# Altium project PCB_DYBoard_Bandmaster_V2.PrjPcb
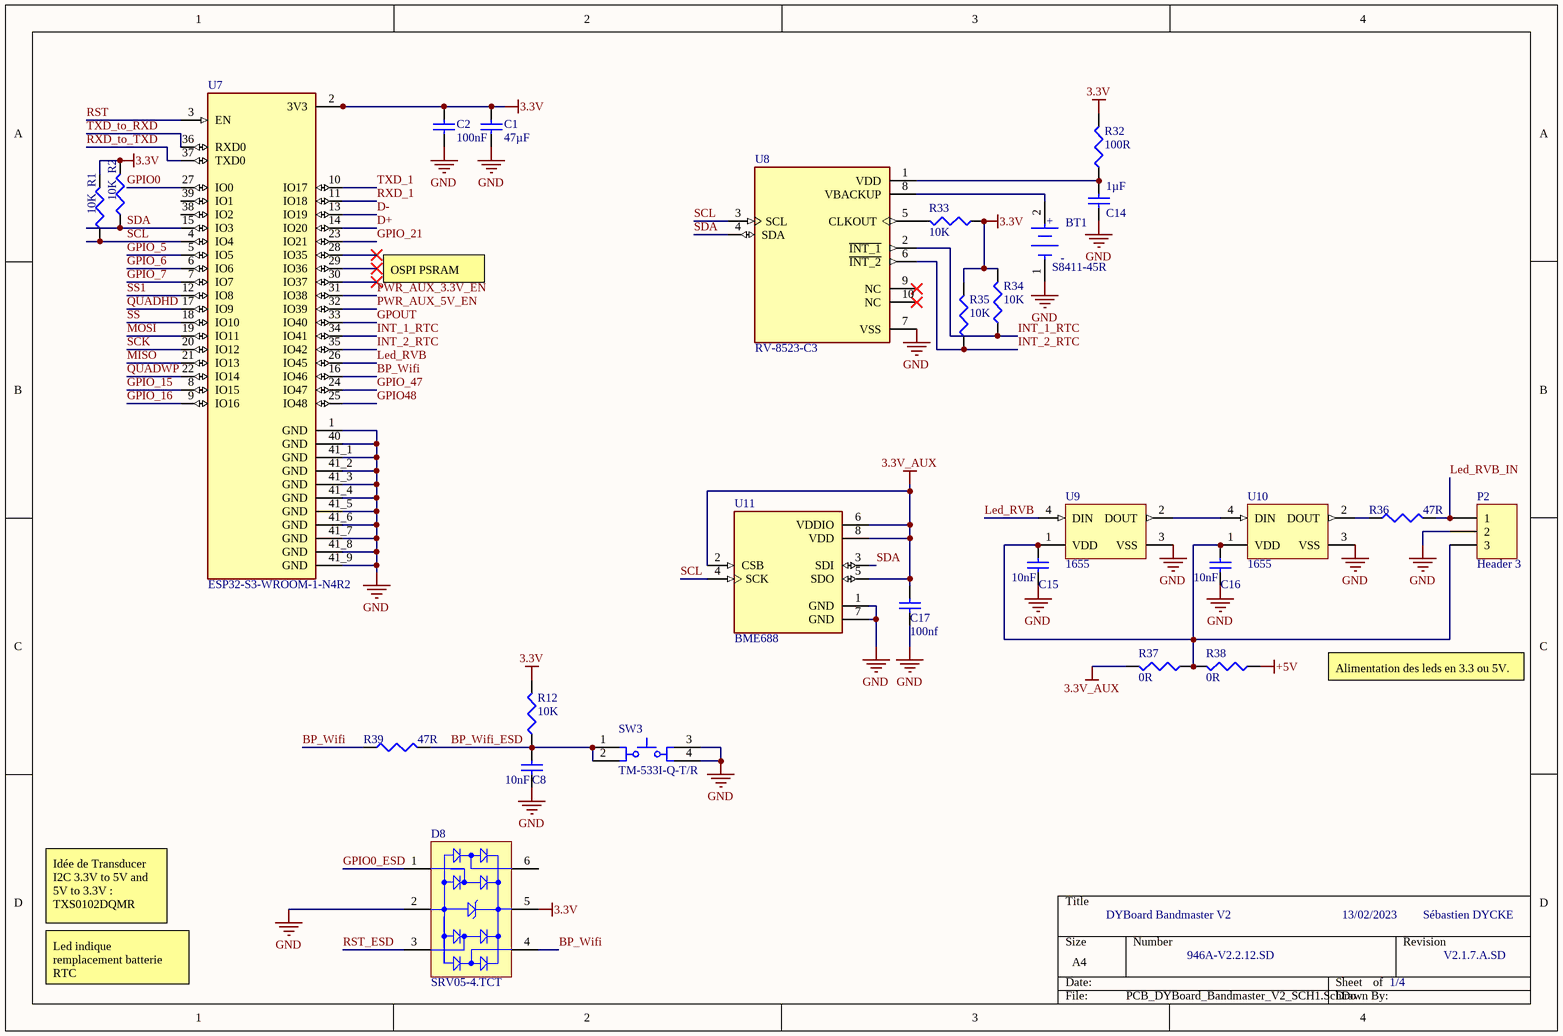
[diagram p0: PCB_DYBoard_Bandmaster_V2_SCH1.SchDoc]
4 sheets, 138 parts. Net scope: global (net labels, ports and power ports of the same name join across sheets).
Board file: PCB_DYBoard_Bandmaster_V2.PcbDoc
Sheets:
  PCB_DYBoard_Bandmaster_V2_SCH1.SchDoc
  PCB_DYBoard_Bandmaster_V2_SCH2.SchDoc
  PCB_DYBoard_Bandmaster_V2_SCH3.SchDoc
  PCB_DYBoard_Bandmaster_V2_SCH4.SchDoc

## Sheet PCB_DYBoard_Bandmaster_V2_SCH1.SchDoc
size A4; SheetNumber: 1; SheetTotal: 4

### Parts
BT1  S8411-45R  [FP-S8411-45R-MFG]
C1  value 47µF  [1608[0603]]  (hidden comment: Cap Semi)
C2  value 100nF  [1608[0603]]  (hidden comment: Cap Semi)
C8  value 10nF  [1608[0603]]  (hidden comment: Cap Semi)
C14  value 1µF  [1608[0603]]  (hidden comment: Cap Semi)
C15  value 10nF  [1608[0603]]  (hidden comment: Cap Semi)
C16  value 10nF  [1608[0603]]  (hidden comment: Cap Semi)
C17  value 100nf  [1608[0603]]  (hidden comment: Cap Semi)
D8  SRV05-4.TCT  [SMTC-SOT23-6_V]
P2  Header 3  [HDR1X3]
R1  value 10K  [J1-0603]  (hidden comment: Res3)
R2  value 10K  [J1-0603]  (hidden comment: Res3)
R12  value 10K  [J1-0603]  (hidden comment: Res3)
R32  value 100R  [J1-0603]  (hidden comment: Res3)
R33  value 10K  [J1-0603]  (hidden comment: Res3)
R34  value 10K  [J1-0603]  (hidden comment: Res3)
R35  value 10K  [J1-0603]  (hidden comment: Res3)
R36  value 47R  [J1-0603]  (hidden comment: Res3)
R37  value 0R  [J1-0603]  (hidden comment: Res3)
R38  value 0R  [J1-0603]  (hidden comment: Res3)
R39  value 47R  [J1-0603]  (hidden comment: Res3)
SW3  TM-533I-Q-T/R  [MULT-TM-533I-Q_V]
U7  ESP32-S3-WROOM-1-N4R2  [XCVR_ESP32-S3-WROOM-1-N4R2]
U8  RV-8523-C3  [IC_RV-8523-C3]
U9  1655  [ADA-RGB-1655_V]
U10  1655  [ADA-RGB-1655_V]
U11  BME688  [IC_BME688]

### Nets
3.3V: C1.2 C2.2 D8.5(VBUS) R1.2 R2.2 R12.2 R32.2 R33.1 R34.2 R35.2 U7.2(3V3)
3.3V_AUX: C17.2 R37.2 U11.2(CSB) U11.5(SDO) U11.6(VDDIO) U11.8(VDD)
+5V: R38.1
GND: BT1.1(C) C1.1 C2.1 C8.1 C14.1 C15.1 C16.1 C17.1 D8.2(GND) P2.2 SW3.3 SW3.4 U7.1(GND) U7.40(GND) U7.41_1(GND) U7.41_2(GND) U7.41_3(GND) U7.41_4(GND) U7.41_5(GND) U7.41_6(GND) U7.41_7(GND) U7.41_8(GND) U7.41_9(GND) U8.7(VSS) U9.3(VSS) U10.3(VSS) U11.1(GND) U11.7(GND)
BP_Wifi: D8.4(I/O_3) R39.1 U7.16(IO46)
BP_Wifi_ESD: C8.2 R12.1 R39.2 SW3.1 SW3.2
D+: U7.14(IO20)
D-: U7.13(IO19)
GPIO0: U7.27(IO0)
GPIO0_ESD: D8.1(I/O_1)
GPIO48: U7.25(IO48)
GPIO_5: U7.5(IO5)
GPIO_6: U7.6(IO6)
GPIO_7: U7.7(IO7)
GPIO_15: U7.8(IO15)
GPIO_16: U7.9(IO16)
GPIO_21: U7.23(IO21)
GPIO_47: U7.24(IO47)
GPOUT: U7.33(IO40)
INT_1_RTC: R34.1 U7.34(IO41) U8.2(~{INT_1})
INT_2_RTC: R35.1 U7.35(IO42) U8.6(~{INT_2})
Led_RVB: U7.26(IO45) U9.4(DIN)
Led_RVB_IN: P2.1 R36.2
MISO: U7.21(IO13)
MOSI: U7.19(IO11)
PWR_AUX_3.3V_EN: U7.31(IO38)
PWR_AUX_5V_EN: U7.32(IO39)
QUADHD: U7.17(IO9)
QUADWP: U7.22(IO14)
RST: U7.3(EN)
RST_ESD: D8.3(I/O_2)
RXD_1: U7.11(IO18)
RXD_to_TXD: U7.37(TXD0)
SCK: U7.20(IO12)
SCL: R1.1 U7.4(IO4) U8.3(SCL) U11.4(SCK)
SDA: R2.1 U7.15(IO3) U8.4(SDA) U11.3(SDI)
SS: U7.18(IO10)
SS1: U7.12(IO8)
TXD_1: U7.10(IO17)
TXD_to_RXD: U7.36(RXD0)
NetBT1_2: BT1.2(A) U8.8(VBACKUP)
NetC14_2: C14.2 R32.1 U8.1(VDD)
NetC15_2: C15.2 C16.2 P2.3 R37.1 R38.2 U9.1(VDD) U10.1(VDD)
NetR33_2: R33.2 U8.5(CLKOUT)
NetR36_1: R36.1 U10.2(DOUT)
NetU9_2: U9.2(DOUT) U10.4(DIN)

Not connected (* = marked no-connect by the designer): D8 6(I/O_4); U7 28(IO35)* 29(IO36)* 30(IO37)* 38(IO2) 39(IO1); U8 9(NC)* 10(NC)*

### Notes on the sheet
- OSPI PSRAM
- Alimentation des leds en 3.3 ou 5V.
- Idée de Transducer I2C 3.3V to 5V and 5V to 3.3V : TXS0102DQMR
- DYBoard Bandmaster V2
- 13/02/2023
- Sébastien DYCKE
- Led indique remplacement batterie RTC
- 946A-V2.2.12.SD
- 1/4
- V2.1.7.A.SD
- (in symbol CMP-15817-000007-1) +; -

### Library data of the parts
BT1 = CMP-15817-000007-1: BATTERY HOLDER COIN 12MM SMD; Number of Batteries: 1; Material: Polyphenylene; Case/Package: SMD/SMT; Number of Cells: 1; Min Operating Temperature: -55°C; Termination: SMD/SMT; REACH SVHC: No SVHC; Contact Plating: Bronze; Package Quantity: 500; Max Operating Temperature: 105°C; Mount: Surface Mount; Packaging: Tape and Reel
C1 C2 C8 C14-C17 = Cap Semi: Capacitor (Semiconductor SIM Model); Published: 8-Jun-2000; LatestRevisionDate: 29-May-2009; LatestRevisionNote: IPC-7351 Footprint Added.; PackageReference: C1206; Publisher: Altium Limited; PackageDescription: Chip Capacitor
D8 = CMP-2000-05358-1: RailClamp(R) Low Capacitance TVS Diode Array, 5 pF, 17.5 VC, -55 to 125 degC, 6-Pin SOT23, RoHS, Tape and Reel; Manufacturer: Semtech; Leakage Current (Max): 5uA; Polarity: Uni-Directional; Peak Pulse Power Dissipation: 300W; Clamping Voltage: 17.5V; Number of Elements: 1; Working Voltage: 5V; Test Current (It): 1mA; Configuration: Quad; Reverse Breakdown Voltage: 6V; Suppressor Type: DiodeArrays; Peak Pulse Current: 12A; Product Depth (mm): 1.6mm; Product Height (mm): 1.15mm; Clamping Voltage (Max): 12.5V; Rad Hardened: No; Product Length (mm): 2.9mm; Capacitance Value: 5pF; Mounting: SurfaceMount; Datasheet URL: https://datasheet.ciiva.com/8029/srv05-4-8029973.pdf; Datasheet Version: Jan-08; Packaging: TapeandReel; Package / Case: SOT-23; Operating Temp Range: -55Cto125C; Pin Count: 6; Direction Type: Uni-Directional; Operating Temperature Min Deg. C: -55C; Reverse Stand-off Voltage: 5V; Leakage Current: 5uA; Manufacturer URL: http://www.semtech.com/; Working Voltage (Max): 5V; Package Reference: SOT23-6; Package Description: 6-Pin Small Outline Transistor, Body 2.9 x 1.6 mm, Pitch 0.95 mm; Operating Temperature Max Deg. C: 125C; Operating Temperature Classification: Military; Mounting Style: SurfaceMount
P2 = Header 3: Header, 3-Pin; LatestRevisionDate: 17-Jul-2002; LatestRevisionNote: Re-released for DXP Platform.; Publisher: Altium Limited
R1 R2 R12 R32-R39 = Res3: Resistor; Published: 8-Jun-2000; LatestRevisionDate: 29-May-2009; LatestRevisionNote: IPC-7351 Footprint Added.; PackageReference: J1-0603; Publisher: Altium Limited; PackageDescription: Chip Resistor
SW3 = CMP-1762-00001-1: TACT Switch, SPNO, -25 to 70 degC, 4-Pin SMD, RoHS, Tape and Reel; PackageDescription: 4-Pin Surface Mount Device, Body 5.2 x 5.2 mm; PackageReference: TM-533I-Q-T/R; DatasheetVersion: Rev. 1.1, 12/2011; ComponentLink1Description: Datasheet; ComponentLink1URL: http://www.micropik.com/PDF/pul5x5.pdf
U7 = ESP32-S3-WROOM-1-N4R2: Bluetooth, WiFi 802.11b/g/n, Bluetooth v5.0 Transceiver Module 2.4GHz PCB Trace Surface Mount; MF: Espressif Systems; Package: None; Purchase-URL: https://pricing.snapeda.com/search/part/ESP32-S3-WROOM-1-N4R2/?ref=eda; Price: None; Availability: In Stock; Check_prices: https://www.snapeda.com/parts/ESP32-S3-WROOM-1-N4R2/Espressif+Systems/view-part/?ref=eda; MP: ESP32-S3-WROOM-1-N4R2; SnapEDA_Link: https://www.snapeda.com/parts/ESP32-S3-WROOM-1-N4R2/Espressif+Systems/view-part/?ref=snap; Value: *
U9 U10 = CMP-2000-05026-1: Intelligent Control LED Integrated Light Source, 3.5 to 5.3 V, -25 to 80 degC, 4-Pin SMD, RoHS, Tape and Reel; Manufacturer: Adafruit-Industries-LLC; Number of LEDs: 10; Configuration: Discrete; Utilized LED: WS2812(5050); Datasheet URL: http://datasheet.octopart.com/ADA1655-Adafruit-Industries-datasheet-32028139.pdf; Series: Neopixel; Interface: -; Package Description: 4-Pin Surface Mount Device, Body 5 x 5 mm; Color: Red,Green,Blue(RGB); Category: Optoelectronics; Controller Type: -; Package Reference: 1655; Manufacturer URL: https://www.adafruit.com/; Mounting Type: SurfaceMount; Datasheet Version: May-13; Size / Dimension: 5.00mmLx5.00mmW; Family: Addressable,Specialty
U11 = BME688: Gas sensor measuring relative humidity, barometric pressure, ambient temperature and gas (VOC); Package: None; MP: BME688; Price: None; Availability: Unavailable; Value: *
U8 = RV-8523-C3: Package: None; Value: *; MP: RV-8523-C3; Availability: Unavailable; Price: None

## Sheet PCB_DYBoard_Bandmaster_V2_SCH2.SchDoc
size A4; SheetNumber: 2; SheetTotal: 4
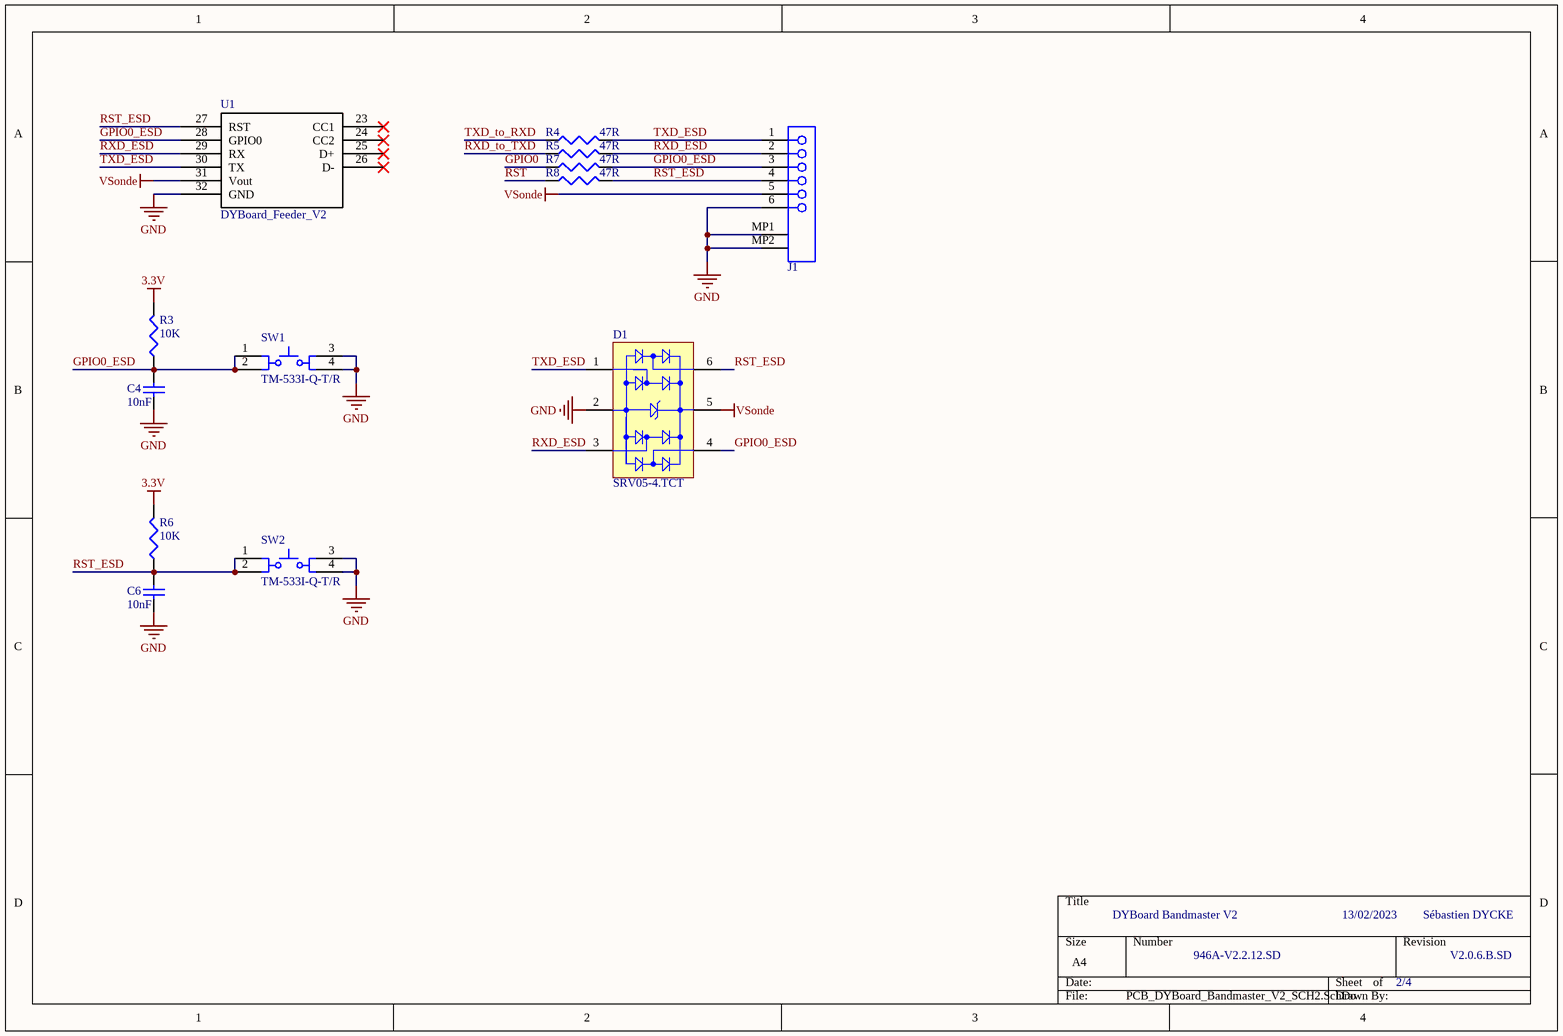
[diagram p1: PCB_DYBoard_Bandmaster_V2_SCH2.SchDoc]

### Parts
C4  value 10nF  [1608[0603]]  (hidden comment: Cap Semi)
C6  value 10nF  [1608[0603]]  (hidden comment: Cap Semi)
D1  SRV05-4.TCT  [SMTC-SOT23-6_V]
J1  SEB_MOLeX_6p  [SEB_MOLeX_6p]  (value not drawn)
R3  value 10K  [J1-0603]  (hidden comment: Res3)
R4  value 47R  [J1-0603]  (hidden comment: Res3)
R5  value 47R  [J1-0603]  (hidden comment: Res3)
R6  value 10K  [J1-0603]  (hidden comment: Res3)
R7  value 47R  [J1-0603]  (hidden comment: Res3)
R8  value 47R  [J1-0603]  (hidden comment: Res3)
SW1  TM-533I-Q-T/R  [MULT-TM-533I-Q_V]
SW2  TM-533I-Q-T/R  [MULT-TM-533I-Q_V]
U1  DYBoard_Feeder_V2  [DYBoard_Feeder_V2]

### Nets
3.3V: R3.2 R6.2
GND: C4.1 C6.1 D1.2(GND) J1.6 J1.MP1 J1.MP2 SW1.3 SW1.4 SW2.3 SW2.4 U1.32(GND)
VSonde: D1.5(VBUS) J1.5 U1.31(Vout)
GPIO0: R7.1
GPIO0_ESD: C4.2 D1.4(I/O_3) J1.3 R3.1 R7.2 SW1.1 SW1.2 U1.28(GPIO0)
RST: R8.1
RST_ESD: C6.2 D1.6(I/O_4) J1.4 R6.1 R8.2 SW2.1 SW2.2 U1.27(RST)
RXD_ESD: D1.3(I/O_2) J1.2 R5.2 U1.29(RX)
RXD_to_TXD: R5.1
TXD_ESD: D1.1(I/O_1) J1.1 R4.2 U1.30(TX)
TXD_to_RXD: R4.1

Not connected (* = marked no-connect by the designer): U1 23(CC1)* 24(CC2)* 25(D+)* 26(D-)*

### Notes on the sheet
- DYBoard Bandmaster V2
- 13/02/2023
- Sébastien DYCKE
- 946A-V2.2.12.SD
- 2/4
- V2.0.6.B.SD

### Library data of the parts
C4 C6 = Cap Semi: Capacitor (Semiconductor SIM Model); Published: 8-Jun-2000; LatestRevisionDate: 29-May-2009; LatestRevisionNote: IPC-7351 Footprint Added.; PackageReference: C1206; Publisher: Altium Limited; PackageDescription: Chip Capacitor
D1 = CMP-2000-05358-1: as D8 on sheet PCB_DYBoard_Bandmaster_V2_SCH1; Mounting: SurfaceMount; Datasheet URL: https://datasheet.ciiva.com/8029/srv05-4-8029973.pdf; Datasheet Version: Jan-08; Packaging: TapeandReel; Package / Case: SOT-23; Operating Temp Range: -55Cto125C; Pin Count: 6; Direction Type: Uni-Directional; Operating Temperature Min Deg. C: -55C; Reverse Stand-off Voltage: 5V; Leakage Current: 5uA; Manufacturer URL: http://www.semtech.com/; Working Voltage (Max): 5V; Package Reference: SOT23-6; Package Description: 6-Pin Small Outline Transistor, Body 2.9 x 1.6 mm, Pitch 0.95 mm; Operating Temperature Max Deg. C: 125C; Operating Temperature Classification: Military; Mounting Style: SurfaceMount
R3-R8 = Res3: Resistor; Published: 8-Jun-2000; LatestRevisionDate: 29-May-2009; LatestRevisionNote: IPC-7351 Footprint Added.; PackageReference: J1-0603; Publisher: Altium Limited; PackageDescription: Chip Resistor
SW1 SW2 = CMP-1762-00001-1: as SW3 on sheet PCB_DYBoard_Bandmaster_V2_SCH1; PackageDescription: 4-Pin Surface Mount Device, Body 5.2 x 5.2 mm; PackageReference: TM-533I-Q-T/R; DatasheetVersion: Rev. 1.1, 12/2011; ComponentLink1Description: Datasheet; ComponentLink1URL: http://www.micropik.com/PDF/pul5x5.pdf

## Sheet PCB_DYBoard_Bandmaster_V2_SCH3.SchDoc
size A4; SheetNumber: 3; SheetTotal: 4; SPICEModelCacheXCLFXDFF: <root> / <DocumentId>XCLFXDFF</DocumentId> / </root>
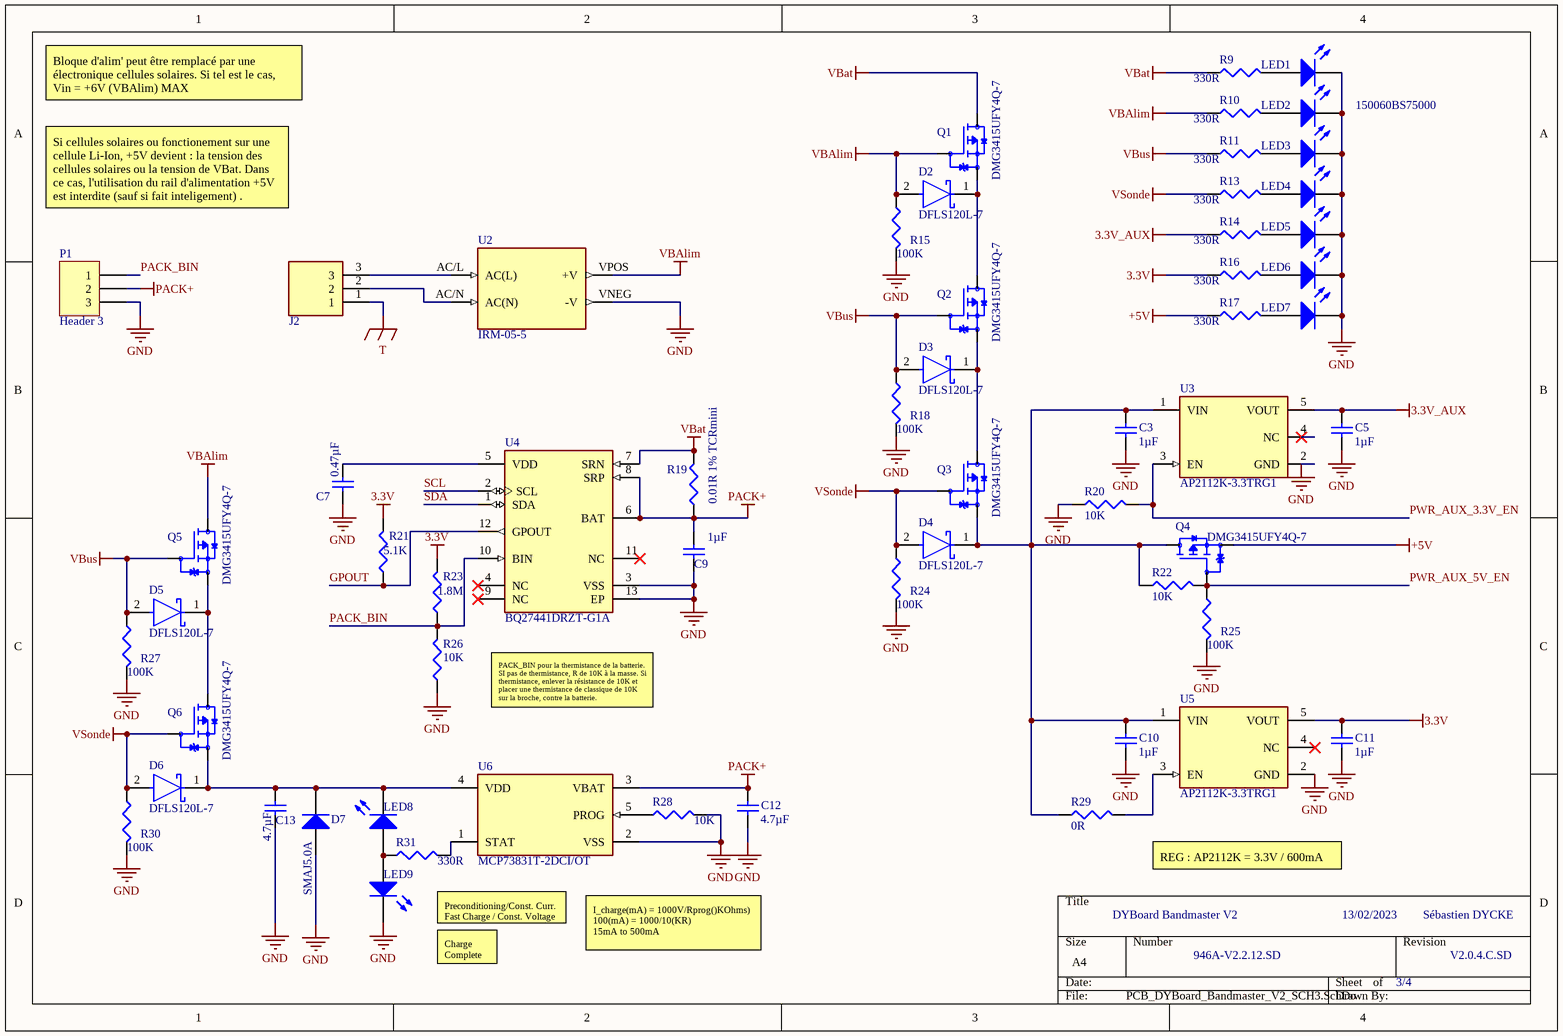
[diagram p2: PCB_DYBoard_Bandmaster_V2_SCH3.SchDoc]

### Parts
C3  value 1µF  [1608[0603]]  (hidden comment: Cap Semi)
C5  value 1µF  [1608[0603]]  (hidden comment: Cap Semi)
C7  value 0.47µF  [1608[0603]]  (hidden comment: Cap Semi)
C9  value 1µF  [1608[0603]]  (hidden comment: Cap Semi)
C10  value 1µF  [1608[0603]]  (hidden comment: Cap Semi)
C11  value 1µF  [1608[0603]]  (hidden comment: Cap Semi)
C12  value 4.7µF  [1608[0603]]  (hidden comment: Cap Semi)
C13  value 4.7µF  [1608[0603]]  (hidden comment: Cap Semi)
D2  DFLS120L-7  [FP-PowerDI123-MFG]
D3  DFLS120L-7  [FP-PowerDI123-MFG]
D4  DFLS120L-7  [FP-PowerDI123-MFG]
D5  DFLS120L-7  [FP-PowerDI123-MFG]
D6  DFLS120L-7  [FP-PowerDI123-MFG]
D7  SMAJ5.0A  [BOUR-SMA-2_V]
J2  TBP02R2-381-03BE  [CUI_TBP02R2-381-03BE]  (value not drawn)
LED1  150060BS75000  [0603_A]  (value not drawn)
LED2  150060BS75000  [0603_A]
LED3  150060BS75000  [0603_A]  (value not drawn)
LED4  150060BS75000  [0603_A]  (value not drawn)
LED5  150060BS75000  [0603_A]  (value not drawn)
LED6  150060BS75000  [0603_A]  (value not drawn)
LED7  150060BS75000  [0603_A]  (value not drawn)
LED8  150060BS75000  [0603_A]  (value not drawn)
LED9  150060BS75000  [0603_A]  (value not drawn)
P1  Header 3  [HDR1X3]
Q1  DMG3415UFY4Q-7  [TRANS_DMG3415UFY4Q-7]
Q2  DMG3415UFY4Q-7  [TRANS_DMG3415UFY4Q-7]
Q3  DMG3415UFY4Q-7  [TRANS_DMG3415UFY4Q-7]
Q4  DMG3415UFY4Q-7  [TRANS_DMG3415UFY4Q-7]
Q5  DMG3415UFY4Q-7  [TRANS_DMG3415UFY4Q-7]
Q6  DMG3415UFY4Q-7  [TRANS_DMG3415UFY4Q-7]
R9  value 330R  [J1-0603]  (hidden comment: Res3)
R10  value 330R  [J1-0603]  (hidden comment: Res3)
R11  value 330R  [J1-0603]  (hidden comment: Res3)
R13  value 330R  [J1-0603]  (hidden comment: Res3)
R14  value 330R  [J1-0603]  (hidden comment: Res3)
R15  value 100K  [J1-0603]  (hidden comment: Res3)
R16  value 330R  [J1-0603]  (hidden comment: Res3)
R17  value 330R  [J1-0603]  (hidden comment: Res3)
R18  value 100K  [J1-0603]  (hidden comment: Res3)
R19  value 0.01R 1% TCRmini  [J1-0603]  (hidden comment: Res3)
R20  value 10K  [J1-0603]  (hidden comment: Res3)
R21  value 5.1K  [J1-0603]  (hidden comment: Res3)
R22  value 10K  [J1-0603]  (hidden comment: Res3)
R23  value 1.8M  [J1-0603]  (hidden comment: Res3)
R24  value 100K  [J1-0603]  (hidden comment: Res3)
R25  value 100K  [J1-0603]  (hidden comment: Res3)
R26  value 10K  [J1-0603]  (hidden comment: Res3)
R27  value 100K  [J1-0603]  (hidden comment: Res3)
R28  value 10K  [J1-0603]  (hidden comment: Res3)
R29  value 0R  [J1-0603]  (hidden comment: Res3)
R30  value 100K  [J1-0603]  (hidden comment: Res3)
R31  value 330R  [J1-0603]  (hidden comment: Res3)
U2  IRM-05-5  [CONV_IRM-05-5]
U3  AP2112K-3.3TRG1  [FP-SOT25-IPC_A]
U4  BQ27441DRZT-G1A  [FP-DRZ0012A-MFG]
U5  AP2112K-3.3TRG1  [FP-SOT25-IPC_A]
U6  MCP73831T-2DCI/OT  [FP-C04-091-OT-IPC_B]

### Nets
3.3V: C11.2 R16.1 R21.2 R23.2 U5.5(VOUT)
3.3V_AUX: C5.2 R14.1 U3.5(VOUT)
+5V: Q4.2(S) R17.1
GND: C3.1 C5.1 C7.1 C9.1 C10.1 C11.1 C12.1 C13.1 D7.1(A) LED1.1(K) LED2.1(K) LED3.1(K) LED4.1(K) LED5.1(K) LED6.1(K) LED7.1(K) LED9.1(K) P1.3 R15.2 R18.2 R20.1 R24.2 R25.2 R26.1 R27.2 R28.2 R30.2 U2.VNEG(-V) U3.2(GND) U4.3(VSS) U4.13(EP) U5.2(GND) U6.2(VSS)
PACK+: C9.2 C12.2 P1.2 R19.1 U4.6(BAT) U4.8(SRP) U6.3(VBAT)
T: J2.1
VBAlim: D2.2(A) Q1.1(G) Q5.3(D) R10.1 R15.1 U2.VPOS(+V)
VBat: Q1.3(D) R9.1 R19.2 U4.7(SRN)
VBus: D3.2(A) D5.2(A) Q2.1(G) Q5.1(G) R11.1 R18.1 R27.1
VSonde: D4.2(A) D6.2(A) Q3.1(G) Q6.1(G) R13.1 R24.1 R30.1
GPOUT: R21.1 U4.12(GPOUT)
PACK_BIN: P1.1 R23.1 R26.2 U4.10(BIN)
PWR_AUX_3.3V_EN: R20.2 U3.3(EN)
PWR_AUX_5V_EN: Q4.1(G) R22.2 R25.1
SCL: U4.2(SCL)
SDA: U4.1(SDA)
NetC3_2: C3.2 C10.2 D4.1(C) Q3.2(S) Q4.3(D) R22.1 R29.1 U3.1(VIN) U5.1(VIN)
NetC7_2: C7.2 U4.5(VDD)
NetC13_2: C13.2 D6.1(C) D7.2(K) LED8.1(K) Q6.2(S) U6.4(VDD)
NetD2_1: D2.1(C) Q1.2(S) Q2.3(D)
NetD3_1: D3.1(C) Q2.2(S) Q3.3(D)
NetD5_1: D5.1(C) Q5.2(S) Q6.3(D)
NetJ2_2: J2.2 U2.AC/N(AC(N))
NetJ2_3: J2.3 U2.AC/L(AC(L))
NetLED1_2: LED1.2(A) R9.2
NetLED2_2: LED2.2(A) R10.2
NetLED3_2: LED3.2(A) R11.2
NetLED4_2: LED4.2(A) R13.2
NetLED5_2: LED5.2(A) R14.2
NetLED6_2: LED6.2(A) R16.2
NetLED7_2: LED7.2(A) R17.2
NetLED8_2: LED8.2(A) LED9.2(A) R31.1
NetR28_1: R28.1 U6.5(PROG)
NetR29_2: R29.2 U5.3(EN)
NetR31_2: R31.2 U6.1(STAT)

Not connected (* = marked no-connect by the designer): U3 4(NC)*; U4 4(NC)* 9(NC)* 11(NC)*; U5 4(NC)*

### Notes on the sheet
- Bloque d'alim' peut être remplacé par une électronique cellules solaires. Si tel est le cas, Vin = +6V (VBAlim) MAX
- Si cellules solaires ou fonctionement sur une cellule Li-Ion, +5V devient : la tension des cellules solaires ou la tension de VBat. Dans ce cas, l'utilisation du rail d'alimentation +5V est interdite (sauf si fait inteligement) .
- PACK_BIN pour la thermistance de la batterie. SI pas de thermistance, R de 10K à la masse. Si thermistance, enlever la résistance de 10K et placer une thermistance de classique de 10K sur la broche, contre la batterie.
- Preconditioning/Const. Curr. Fast Charge / Const. Voltage
- DYBoard Bandmaster V2
- REG : AP2112K = 3.3V / 600mA
- 13/02/2023
- Sébastien DYCKE
- Charge Complete
- I_charge(mA) = 1000V/Rprog()KOhms) 100(mA) = 1000/10(KR)                   15mA to 500mA
- 946A-V2.2.12.SD
- 3/4
- V2.0.4.C.SD

### Library data of the parts
C3 C5 C7 C9-C13 = Cap Semi: Capacitor (Semiconductor SIM Model); Published: 8-Jun-2000; LatestRevisionDate: 29-May-2009; LatestRevisionNote: IPC-7351 Footprint Added.; PackageReference: C1206; Publisher: Altium Limited; PackageDescription: Chip Capacitor
D2-D6 = CMP-12790-000036-1: DIODE SCHOTTKY 20V 1A POWERDI123; Manufacturer: Diodes Inc.; Value: 75pF; Automotive Grade: Grade 1; Max Junction Temp: +125°C; Peak Reverse Current: 1mA; Max Surge Forward Current: 50A; Height: 1mm; Footprint Url: https://www.diodes.com/assets/Package-Files/PowerDI123.pdf; Device Class L3: Schottky Diodes; Mouser Description: Schottky Diodes & Rectifiers 1A 20V; Lead Free: Yes; Reverse Voltage: 20V; Forward Current: 1A; ComponentLink2Description: Datasheet; Automotive: Yes; Max Repetitive Reverse Voltage: 20V; Package: PowerDI123; RoHS: TRUE; Octopart: https://octopart.com/dfls120l-7-diodes+inc.-328569; ComponentLink2URL: https://www.diodes.com/assets/Datasheets/ds30444.pdf; Temperature: -55°C to +125°C; Temperature Range Low: -55°C; Device Class L1: Discrete Semiconductors; Category: Diode; Device Class L2: Diodes; Digikey Description: DIODE SCHOTTKY 20V 1A POWERDI123; Capacitance: 75pF; Temperature Range High: +125°C; Manufacturer Part Number: DFLS120L-7
D7 = CMP-2000-07090-1: SMAJ Transient Voltage Suppressor Diode Series, 3.5 V, -55 to 150 degC, 2-Pin SMA, RoHS, Tape and Reel; Manufacturer: Bourns; EDA / CAD Models: DownloadfromAcceleratedDesigns; Unidirectional Channels: 1; Voltage - Breakdown (Min): 6.4V; Voltage - Reverse Standoff (Typ): 5V; Voltage - Clamping (Max) @ Ipp: 9.2V; Other Names: SMAJ5.0ABDKR; Type: Zener; Catalog Drawings: SMAJSeriesFootprintSMAJ,SMBJSeries; Featured Product: SMAJ/SMBJ/SMCJ/SMLJDiscreteTVSDiodes; Power - Peak Pulse: 400W; Current - Peak Pulse (10/1000µs): 43.5A; Power Line Protection: No; Online Catalog: SMAJSeries; Supplier Device Package: SMA(DO-214AC); Operating Temperature: -55°C~150°C(TJ); Package Description: 2-Pin Surface Mount Device, Body 4.315 x 2.605 mm; Datasheet URL: https://datasheet.ciiva.com/25624/0900766b8112213b-25624680.pdf; Manufacturer URL: http://www.bourns.com/; Datasheet Version: 08/2012; Series: SMAJ; Family: TVS-Diodes; Bidirectional Channels: -; Applications: GeneralPurpose; Package Reference: SMA-2; Standard Package: 1; Package / Case: DO-214AC,SMA; Category: CircuitProtection; RoHS Information: SMAJSeriesMaterialDeclaration; Mounting Technology: SurfaceMount; Capacitance @ Frequency: -; Packaging: Digi-Reel®; Mounting Type: SurfaceMount
J2 = TBP02R2-381-03BE: 2~24 Poles, Pluggable, Receptacle, Vertical, 3.81 Pitch, Terminal Block Connector; MF: CUI Devices; CUI_purchase_URL: https://www.cuidevices.com/product/interconnect/connectors/terminal-blocks/tbp02r2-381-series?utm_source=snapeda.com&utm_medium=referral&utm_campaign=snapedaBOM; Value: *; Price: None; Check_prices: https://www.snapeda.com/parts/TBP02R2-381-03BE/CUI+Devices/view-part/?ref=eda; Package: None; Availability: In Stock; Purchase-URL: https://pricing.snapeda.com/search/part/TBP02R2-381-03BE/?ref=eda; SnapEDA_Link: https://www.snapeda.com/parts/TBP02R2-381-03BE/CUI+Devices/view-part/?ref=snap; MP: TBP02R2-381-03BE
LED1-LED9 = CMP-1426-00003-1: SMD mono-color Chip LED, WL-SMCW, Blue; Manufacturer: Wuerth Elektronik; Color: Blue; ComponentLink2Description: Datasheet; ComponentLink2URL: http://katalog.we-online.com/led/datasheet/150060BS75000.pdf; ComponentLink1URL: http://www.we-online.com; PackageReference: 0603_A; PartNumber: 150060BS75000; ComponentLink1Description: Manufacturer URL
P1 = Header 3: Header, 3-Pin; LatestRevisionDate: 17-Jul-2002; LatestRevisionNote: Re-released for DXP Platform.; Publisher: Altium Limited
Q1-Q6 = DMG3415UFY4Q-7: P-Channel 16V 2.5A _Ta_ 650mW _Ta_ Surface Mount X2-DFN2015-3; MF: Diodes Inc.; SnapEDA_Link: https://www.snapeda.com/parts/DMG3415UFY4Q-7/Diodes%20Inc./view-part/653971/?ref=snap; MP: DMG3415UFY4Q-7; Value: *; Package: DFN-2 Diodes Inc.; Digi-Key_Part_Number: DMG3415UFY4Q-7DICT-ND
R9-R11 R13-R31 = Res3: Resistor; Published: 8-Jun-2000; LatestRevisionDate: 29-May-2009; LatestRevisionNote: IPC-7351 Footprint Added.; PackageReference: J1-0603; Publisher: Altium Limited; PackageDescription: Chip Resistor
U2 = IRM-05-5: Enclosed AC DC Converters 1 Uitgang 5V 1A 85 ~ 305 VAC, 120 ~ 430 VDC Input; MF: MEAN WELL; MP: IRM-05-5; Availability: Unavailable; Package: DIP-4 Mean Well; Value: *; Price: None; SnapEDA_Link: https://www.snapeda.com/parts/IRM-05-5/MEAN%20WELL%20USA%20Inc./view-part/364712/?ref=snap
U3 U5 = CMP-12756-000035-1: IC REG LINEAR 3.3V 600MA SOT25; Number of Regulators: 1; Output Type: Fixed; Polarity: Positive; Min Input Voltage: 2.5V; Max Input Voltage: 6V; Accuracy: 1.5%; Quiescent Current: 55uA; Dropout Voltage: 250mV; Min Operating Temperature: -40°C; Length: 3.1mm; Output Current: 600mA; Max Operating Temperature: 85°C; Package Quantity: 1; Output Voltage: 3.3V; Width: 1.7mm; Number of Outputs: 1; Packaging: Tape and Reel; Height: 1.3mm; Lead Free: Lead Free; Max Output Current: 600mA; Case/Package: SOT-23-5; Mount: Surface Mount; Number of Pins: 5
U4 = CMP-04911-000005-1: IC BATT FUEL GAUGE LICOO2 12SON; Manufacturer: Texas Instruments; Nominal Supply Current: 93uA; Standoff Height: 0mm; Output Voltage: 1.8V; Number Of Outputs: 1; Min Supply Voltage: 2.45V; Max Supply Voltage: 4.5V; ComponentLink2URL: http://www.ti.com/lit/ds/symlink/bq27441-g1.pdf; Device Class L1: Integrated Circuits (ICs); Package: DRZ0012A; Number Of Cells: 1; Mouser Description: Battery Management System-Side Impdance Trck Bttry Fuel Gge; ComponentLink2Description: Datasheet; Device Class L2: Power Management ICs; Temperature Range High: +85°C; Category: IC; Automotive: No; Octopart: https://octopart.com/bq27441drzt-g1a-texas+instruments-30555831; Temperature Range Low: -40°C; Device Class L3: Battery Management; RoHS: TRUE; Height: 1mm; Digikey Description: IC BATT FUEL GAUGE LICOO2 12SON; Temperature: -40°C to +85°C; Ambient Temperature Range High: +85°C; Ambient Temperature Range Low: -40°C; Manufacturer Part Number: BQ27441DRZT-G1A; Lead Free: Yes
U6 = CMP-0133-00146-2: IC CONTROLLR LI-ION 4.2V SOT23-5; Max Charge Current: 500mA; Min Output Voltage: 4.168V; Max Supply Voltage: 6V; Max Output Voltage: 4.232V; Number of Cells: 1; Operating Supply Current: 510uA; Min Supply Voltage: 3.75V; Max Output Current: 500mA; Case/Package: SOT-23; Radiation Hardening: No; REACH SVHC: No SVHC; Package Quantity: 3000; Output Current: 500mA; Number of Channels: 1; Output Voltage: 4.2V; Max Operating Temperature: 85°C; Number of Pins: 5; Mount: Surface Mount; Length: 3.1mm; Contact Plating: Tin; Packaging: Tape and Reel; Width: 1.8mm; Min Operating Temperature: -40°C; Max Input Voltage: 3.75V; Height: 1.3mm; Lead Free: Lead Free

## Sheet PCB_DYBoard_Bandmaster_V2_SCH4.SchDoc
size A4; SheetNumber: 4; SheetTotal: 4
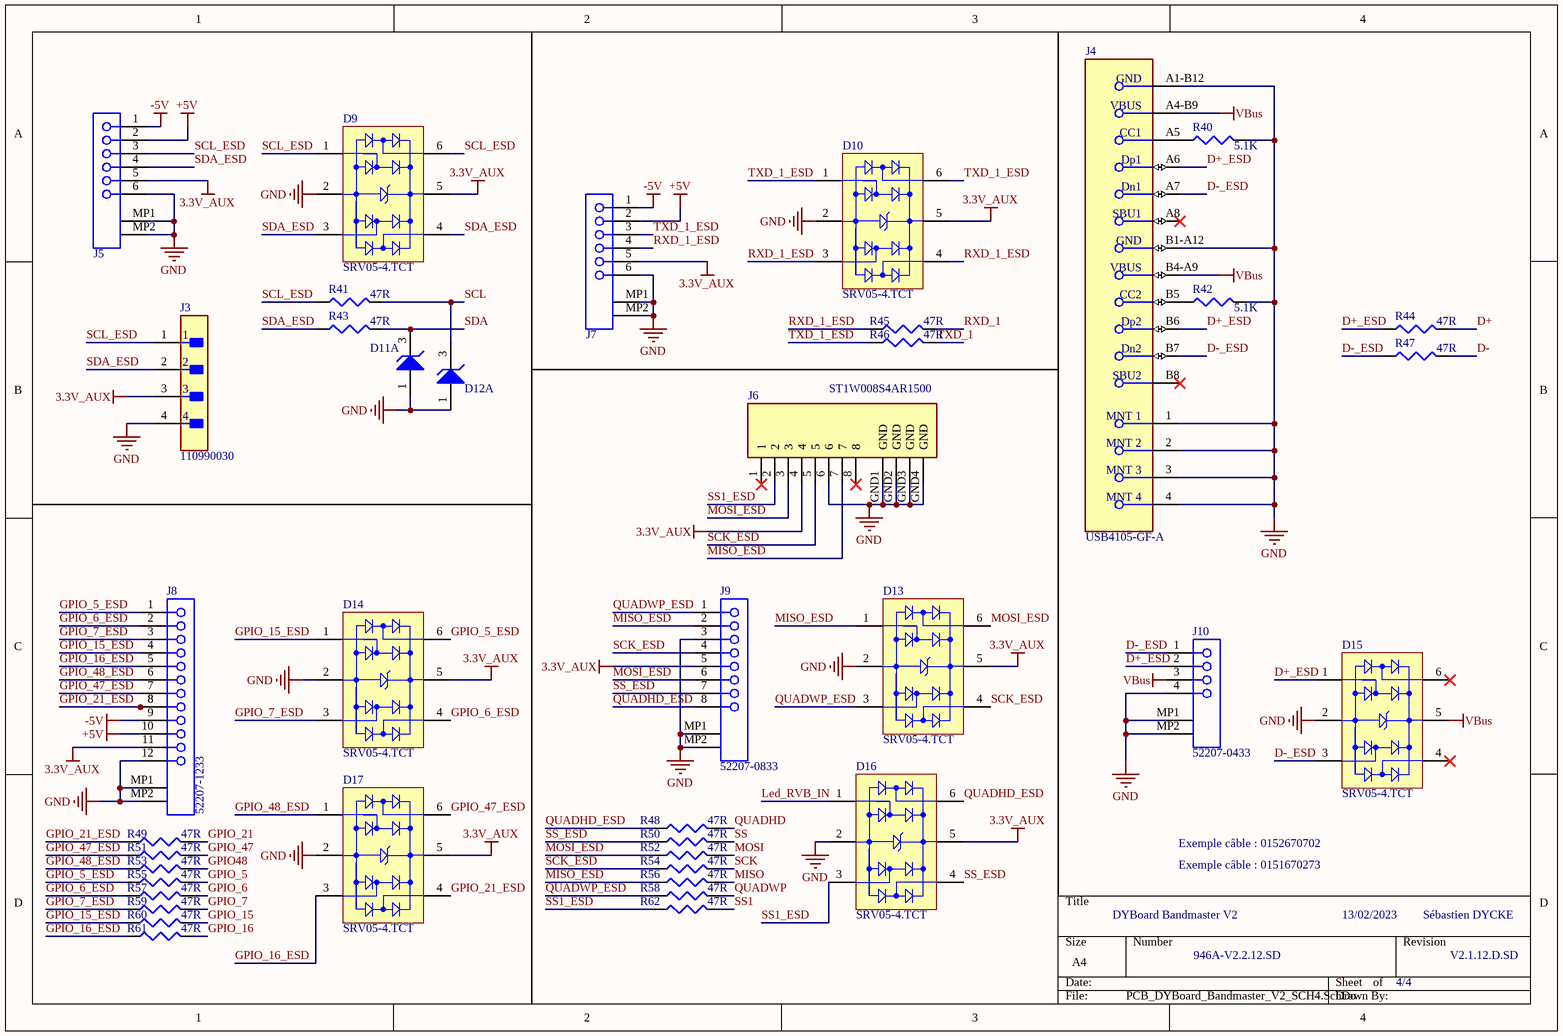
[diagram p3: PCB_DYBoard_Bandmaster_V2_SCH4.SchDoc]

### Parts
D9  SRV05-4.TCT  [SMTC-SOT23-6_V]
D10  SRV05-4.TCT  [SMTC-SOT23-6_V]
D11  BZX84C3V9LT1G  [ONSC-SOT-23-3-318-08_V]  (value not drawn)  (part A of 2)
D12  BZX84C3V9LT1G  [ONSC-SOT-23-3-318-08_V]  (value not drawn)  (part A of 2)
D13  SRV05-4.TCT  [SMTC-SOT23-6_V]
D14  SRV05-4.TCT  [SMTC-SOT23-6_V]
D15  SRV05-4.TCT  [SMTC-SOT23-6_V]
D16  SRV05-4.TCT  [SMTC-SOT23-6_V]
D17  SRV05-4.TCT  [SMTC-SOT23-6_V]
J3  110990030  [FP-110990030-MFG]
J4  USB4105-GF-A  [FP-USB4105-GF-A-MFG]
J5  SEB_MOLeX_6p  [SEB_MOLeX_6p]  (value not drawn)
J6  ST1W008S4AR1500  [JAE_ST1W008S4AR1500]
J7  SEB_MOLeX_6p  [SEB_MOLeX_6p]  (value not drawn)
J8  52207-1233  [52207-1233]
J9  52207-0833  [con_molex_8_52207-0833]
J10  52207-0433  [52207-0433]
R40  value 5.1K  [J1-0603]  (hidden comment: Res3)
R41  value 47R  [J1-0603]  (hidden comment: Res3)
R42  value 5.1K  [J1-0603]  (hidden comment: Res3)
R43  value 47R  [J1-0603]  (hidden comment: Res3)
R44  value 47R  [J1-0603]  (hidden comment: Res3)
R45  value 47R  [J1-0603]  (hidden comment: Res3)
R46  value 47R  [J1-0603]  (hidden comment: Res3)
R47  value 47R  [J1-0603]  (hidden comment: Res3)
R48  value 47R  [J1-0603]  (hidden comment: Res3)
R49  value 47R  [J1-0603]  (hidden comment: Res3)
R50  value 47R  [J1-0603]  (hidden comment: Res3)
R51  value 47R  [J1-0603]  (hidden comment: Res3)
R52  value 47R  [J1-0603]  (hidden comment: Res3)
R53  value 47R  [J1-0603]  (hidden comment: Res3)
R54  value 47R  [J1-0603]  (hidden comment: Res3)
R55  value 47R  [J1-0603]  (hidden comment: Res3)
R56  value 47R  [J1-0603]  (hidden comment: Res3)
R57  value 47R  [J1-0603]  (hidden comment: Res3)
R58  value 47R  [J1-0603]  (hidden comment: Res3)
R59  value 47R  [J1-0603]  (hidden comment: Res3)
R60  value 47R  [J1-0603]  (hidden comment: Res3)
R61  value 47R  [J1-0603]  (hidden comment: Res3)
R62  value 47R  [J1-0603]  (hidden comment: Res3)

### Nets
3.3V_AUX: D9.5(VBUS) D10.5(VBUS) D13.5(VBUS) D14.5(VBUS) D16.5(VBUS) D17.5(VBUS) J3.3 J5.5 J6.4 J7.5 J8.11 J9.5
+5V: J5.2 J7.2 J8.10
-5V: J5.1 J7.1 J8.9
GND: D9.2(GND) D10.2(GND) D11.1(A) D12.1(A) D13.2(GND) D14.2(GND) D15.2(GND) D16.2(GND) D17.2(GND) J3.4 J4.1(MNT_1) J4.2(MNT_2) J4.3(MNT_3) J4.4(MNT_4) J4.A1-B12(GND) J4.B1-A12(GND) J5.6 J5.MP1 J5.MP2 J6.6 J6.GND1(GND) J6.GND2(GND) J6.GND3(GND) J6.GND4(GND) J7.6 J7.MP1 J7.MP2 J8.12 J8.MP1 J8.MP2 J9.3 J9.MP1 J9.MP2 J10.4 J10.MP1 J10.MP2 R40.2 R42.2
VBus: D15.5(VBUS) J4.A4-B9(VBUS) J4.B4-A9(VBUS) J10.3
D+: R44.2
D+_ESD: D15.1(I/O_1) J4.A6(Dp1) J4.B6(Dp2) J10.2 R44.1
D-: R47.2
D-_ESD: D15.3(I/O_2) J4.A7(Dn1) J4.B7(Dn2) J10.1 R47.1
GPIO48: R53.2
GPIO_5: R55.2
GPIO_5_ESD: D14.6(I/O_4) J8.1 R55.1
GPIO_6: R57.2
GPIO_6_ESD: D14.4(I/O_3) J8.2 R57.1
GPIO_7: R59.2
GPIO_7_ESD: D14.3(I/O_2) J8.3 R59.1
GPIO_15: R60.2
GPIO_15_ESD: D14.1(I/O_1) J8.4 R60.1
GPIO_16: R61.2
GPIO_16_ESD: D17.3(I/O_2) J8.5 R61.1
GPIO_21: R49.2
GPIO_21_ESD: D17.4(I/O_3) J8.8 R49.1
GPIO_47: R51.2
GPIO_47_ESD: D17.6(I/O_4) J8.7 R51.1
GPIO_48_ESD: D17.1(I/O_1) J8.6 R53.1
Led_RVB_IN: D16.1(I/O_1)
MISO: R56.2
MISO_ESD: D13.1(I/O_1) J6.7 J9.2 R56.1
MOSI: R52.2
MOSI_ESD: D13.6(I/O_4) J6.3 J9.6 R52.1
QUADHD: R48.2
QUADHD_ESD: D16.6(I/O_4) J9.8 R48.1
QUADWP: R58.2
QUADWP_ESD: D13.3(I/O_2) J9.1 R58.1
RXD_1: R45.2
RXD_1_ESD: D10.3(I/O_2) D10.4(I/O_3) J7.4 R45.1
SCK: R54.2
SCK_ESD: D13.4(I/O_3) J6.5 J9.4 R54.1
SCL: D12.3(K) R41.2
SCL_ESD: D9.1(I/O_1) D9.6(I/O_4) J3.1 J5.3 R41.1
SDA: D11.3(K) R43.2
SDA_ESD: D9.3(I/O_2) D9.4(I/O_3) J3.2 J5.4 R43.1
SS: R50.2
SS1: R62.2
SS1_ESD: D16.3(I/O_2) J6.2 R62.1
SS_ESD: D16.4(I/O_3) J9.7 R50.1
TXD_1: R46.2
TXD_1_ESD: D10.1(I/O_1) D10.6(I/O_4) J7.3 R46.1
NetJ4_A5: J4.A5(CC1) R40.1
NetJ4_B5: J4.B5(CC2) R42.1

Not connected (* = marked no-connect by the designer): D15 4(I/O_3)* 6(I/O_4)*; J4 A8(SBU1)* B8(SBU2)*; J6 1* 8*

### Notes on the sheet
- Exemple câble : 0152670702
- DYBoard Bandmaster V2
- Exemple câble : 0151670273
- 13/02/2023
- Sébastien DYCKE
- 946A-V2.2.12.SD
- 4/4
- V2.1.12.D.SD

### Library data of the parts
D9 D10 D13-D17 = CMP-2000-05358-1: as D8 on sheet PCB_DYBoard_Bandmaster_V2_SCH1; Mounting: SurfaceMount; Datasheet URL: https://datasheet.ciiva.com/8029/srv05-4-8029973.pdf; Datasheet Version: Jan-08; Packaging: TapeandReel; Package / Case: SOT-23; Operating Temp Range: -55Cto125C; Pin Count: 6; Direction Type: Uni-Directional; Operating Temperature Min Deg. C: -55C; Reverse Stand-off Voltage: 5V; Leakage Current: 5uA; Manufacturer URL: http://www.semtech.com/; Working Voltage (Max): 5V; Package Reference: SOT23-6; Package Description: 6-Pin Small Outline Transistor, Body 2.9 x 1.6 mm, Pitch 0.95 mm; Operating Temperature Max Deg. C: 125C; Operating Temperature Classification: Military; Mounting Style: SurfaceMount
D11 D12 = CMP-1060-01129-1: Zener Voltage Regulator, 225 mW, 3-Pin SOT-23, Pb-Free, Tape and Reel; Manufacturer: On Semiconductor; ComponentLink3URL: http://www.onsemi.cn/pub_link/Collateral/318-08.PDF; PartNumber: BZX84C3V9LT1G; ComponentLink2URL: http://www.onsemi.com/pub_link/Collateral/BZX84C2V4LT1-D.PDF; PackageReference: SOT-23-3-318-08; DatasheetVersion: Rev. 17; ComponentLink3Description: Package Specification; ComponentLink1Description: Manufacturer URL; Packing: Tape and Reel; ComponentLink1URL: http://www.onsemi.com/; RoHS: Pb-Free; PackageVersion: Rev. AP, 11/2009; Mounting Technology: Surface Mount; PackageDescription: 3-Pin Small Outline Transistor, Body 2.92 x 1.3 mm, Pitch 0.95 mm; ComponentLink2Description: Datasheet
J3 = CMP-139044-000001-1: GROVE 2MM 4PIN VERT CONN 10PCS; Series: -
J4 = CMP-245163-000001-1: CONN RCPT USB2.0 TYPEC 5A; Manufacturer: GCT; Voltage Rating: 20V; Is Female: yes; Current Rating: 5/6.25/1.25/0.25A; Number Of Contacts: 16; Conn Orientation: Right Angle; Device Class L1: Connectors; Category: Conn; Lead Free: Yes; RoHS: TRUE; Temperature Range High: +85°C; Digikey Description: CONN RCPT USB2.0 TYPEC 5A; Device Class L3: unset; ComponentLink2Description: Datasheet; Manufacturer Part Number: USB4105-GF-A; Package: 0; Usb Standard: USB 2.0; Device Class L2: USB Connectors; Automotive: No; Temperature Range Low: -40°C; Height: 3.46mm; Temperature: -40°C to +85°C; Contact Material: Gold,Nickel; ComponentLink2URL: https://gct.co/files/drawings/usb4105.pdf; Octopart: https://octopart.com/usb4105-gf-a-gct-106627878
J6 = ST1W008S4AR1500: 8 Position Card Connector Secure Digital - microSDâ„¢ Surface Mount, Right Angle Gold; MF: JAE Electronics; SnapEDA_Link: https://www.snapeda.com/parts/ST1W008S4AR1500/JAE%20Electronics/view-part/423641/?ref=snap; Price: None; MP: ST1W008S4AR1500; Value: *; Availability: Warning; Purchase-URL: https://pricing.snapeda.com/search/part/ST1W008S4AR1500/?ref=eda; Package: None; Check_prices: https://www.snapeda.com/parts/ST1W008S4AR1500/JAE%20Electronics/view-part/423641/?ref=eda
R40-R62 = Res3: Resistor; Published: 8-Jun-2000; LatestRevisionDate: 29-May-2009; LatestRevisionNote: IPC-7351 Footprint Added.; PackageReference: J1-0603; Publisher: Altium Limited; PackageDescription: Chip Resistor

## Nets that join several sheets
3.3V: PCB_DYBoard_Bandmaster_V2_SCH1 (11 pins), PCB_DYBoard_Bandmaster_V2_SCH2 (R3.2 R6.2), PCB_DYBoard_Bandmaster_V2_SCH3 (5 pins)
3.3V_AUX: PCB_DYBoard_Bandmaster_V2_SCH1 (6 pins), PCB_DYBoard_Bandmaster_V2_SCH3 (C5.2 R14.1 U3.5), PCB_DYBoard_Bandmaster_V2_SCH4 (12 pins)
+5V: PCB_DYBoard_Bandmaster_V2_SCH1 (R38.1), PCB_DYBoard_Bandmaster_V2_SCH3 (Q4.2 R17.1), PCB_DYBoard_Bandmaster_V2_SCH4 (J5.2 J7.2 J8.10)
GND: PCB_DYBoard_Bandmaster_V2_SCH1 (28 pins), PCB_DYBoard_Bandmaster_V2_SCH2 (11 pins), PCB_DYBoard_Bandmaster_V2_SCH3 (33 pins), PCB_DYBoard_Bandmaster_V2_SCH4 (38 pins)
VBus: PCB_DYBoard_Bandmaster_V2_SCH3 (7 pins), PCB_DYBoard_Bandmaster_V2_SCH4 (D15.5 J4.A4-B9 J4.B4-A9 J10.3)
VSonde: PCB_DYBoard_Bandmaster_V2_SCH2 (D1.5 J1.5 U1.31), PCB_DYBoard_Bandmaster_V2_SCH3 (7 pins)
D+: PCB_DYBoard_Bandmaster_V2_SCH1 (U7.14), PCB_DYBoard_Bandmaster_V2_SCH4 (R44.2)
D-: PCB_DYBoard_Bandmaster_V2_SCH1 (U7.13), PCB_DYBoard_Bandmaster_V2_SCH4 (R47.2)
GPIO0: PCB_DYBoard_Bandmaster_V2_SCH1 (U7.27), PCB_DYBoard_Bandmaster_V2_SCH2 (R7.1)
GPIO0_ESD: PCB_DYBoard_Bandmaster_V2_SCH1 (D8.1), PCB_DYBoard_Bandmaster_V2_SCH2 (8 pins)
GPIO48: PCB_DYBoard_Bandmaster_V2_SCH1 (U7.25), PCB_DYBoard_Bandmaster_V2_SCH4 (R53.2)
GPIO_5: PCB_DYBoard_Bandmaster_V2_SCH1 (U7.5), PCB_DYBoard_Bandmaster_V2_SCH4 (R55.2)
GPIO_6: PCB_DYBoard_Bandmaster_V2_SCH1 (U7.6), PCB_DYBoard_Bandmaster_V2_SCH4 (R57.2)
GPIO_7: PCB_DYBoard_Bandmaster_V2_SCH1 (U7.7), PCB_DYBoard_Bandmaster_V2_SCH4 (R59.2)
GPIO_15: PCB_DYBoard_Bandmaster_V2_SCH1 (U7.8), PCB_DYBoard_Bandmaster_V2_SCH4 (R60.2)
GPIO_16: PCB_DYBoard_Bandmaster_V2_SCH1 (U7.9), PCB_DYBoard_Bandmaster_V2_SCH4 (R61.2)
GPIO_21: PCB_DYBoard_Bandmaster_V2_SCH1 (U7.23), PCB_DYBoard_Bandmaster_V2_SCH4 (R49.2)
GPIO_47: PCB_DYBoard_Bandmaster_V2_SCH1 (U7.24), PCB_DYBoard_Bandmaster_V2_SCH4 (R51.2)
GPOUT: PCB_DYBoard_Bandmaster_V2_SCH1 (U7.33), PCB_DYBoard_Bandmaster_V2_SCH3 (R21.1 U4.12)
Led_RVB_IN: PCB_DYBoard_Bandmaster_V2_SCH1 (P2.1 R36.2), PCB_DYBoard_Bandmaster_V2_SCH4 (D16.1)
MISO: PCB_DYBoard_Bandmaster_V2_SCH1 (U7.21), PCB_DYBoard_Bandmaster_V2_SCH4 (R56.2)
MOSI: PCB_DYBoard_Bandmaster_V2_SCH1 (U7.19), PCB_DYBoard_Bandmaster_V2_SCH4 (R52.2)
PWR_AUX_3.3V_EN: PCB_DYBoard_Bandmaster_V2_SCH1 (U7.31), PCB_DYBoard_Bandmaster_V2_SCH3 (R20.2 U3.3)
PWR_AUX_5V_EN: PCB_DYBoard_Bandmaster_V2_SCH1 (U7.32), PCB_DYBoard_Bandmaster_V2_SCH3 (Q4.1 R22.2 R25.1)
QUADHD: PCB_DYBoard_Bandmaster_V2_SCH1 (U7.17), PCB_DYBoard_Bandmaster_V2_SCH4 (R48.2)
QUADWP: PCB_DYBoard_Bandmaster_V2_SCH1 (U7.22), PCB_DYBoard_Bandmaster_V2_SCH4 (R58.2)
RST: PCB_DYBoard_Bandmaster_V2_SCH1 (U7.3), PCB_DYBoard_Bandmaster_V2_SCH2 (R8.1)
RST_ESD: PCB_DYBoard_Bandmaster_V2_SCH1 (D8.3), PCB_DYBoard_Bandmaster_V2_SCH2 (8 pins)
RXD_1: PCB_DYBoard_Bandmaster_V2_SCH1 (U7.11), PCB_DYBoard_Bandmaster_V2_SCH4 (R45.2)
RXD_to_TXD: PCB_DYBoard_Bandmaster_V2_SCH1 (U7.37), PCB_DYBoard_Bandmaster_V2_SCH2 (R5.1)
SCK: PCB_DYBoard_Bandmaster_V2_SCH1 (U7.20), PCB_DYBoard_Bandmaster_V2_SCH4 (R54.2)
SCL: PCB_DYBoard_Bandmaster_V2_SCH1 (R1.1 U7.4 U8.3 U11.4), PCB_DYBoard_Bandmaster_V2_SCH3 (U4.2), PCB_DYBoard_Bandmaster_V2_SCH4 (D12.3 R41.2)
SDA: PCB_DYBoard_Bandmaster_V2_SCH1 (R2.1 U7.15 U8.4 U11.3), PCB_DYBoard_Bandmaster_V2_SCH3 (U4.1), PCB_DYBoard_Bandmaster_V2_SCH4 (D11.3 R43.2)
SS: PCB_DYBoard_Bandmaster_V2_SCH1 (U7.18), PCB_DYBoard_Bandmaster_V2_SCH4 (R50.2)
SS1: PCB_DYBoard_Bandmaster_V2_SCH1 (U7.12), PCB_DYBoard_Bandmaster_V2_SCH4 (R62.2)
TXD_1: PCB_DYBoard_Bandmaster_V2_SCH1 (U7.10), PCB_DYBoard_Bandmaster_V2_SCH4 (R46.2)
TXD_to_RXD: PCB_DYBoard_Bandmaster_V2_SCH1 (U7.36), PCB_DYBoard_Bandmaster_V2_SCH2 (R4.1)